# Altium schematic sheet TX1Powerthing.SchDoc
size A
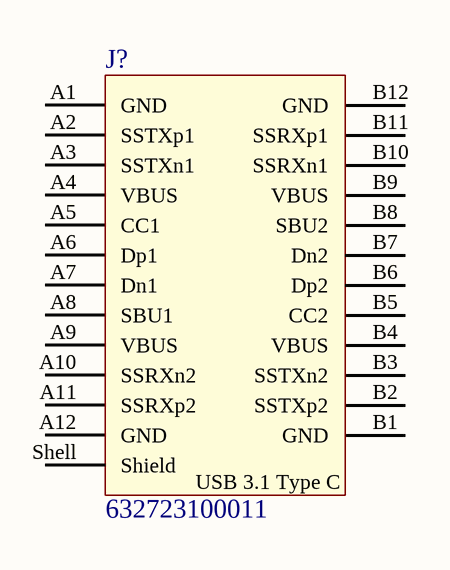
[diagram p0: TX1Powerthing.SchDoc]

## Parts
J?  632723100011  [632723100011]

## Nets

Not connected (* = marked no-connect by the designer): J? A1(GND) A2(SSTXp1) A3(SSTXn1) A4(VBUS) A5(CC1) A6(Dp1) A7(Dn1) A8(SBU1) A9(VBUS) A10(SSRXn2) A11(SSRXp2) A12(GND) B1(GND) B2(SSTXp2) B3(SSTXn2) B4(VBUS) B5(CC2) B6(Dp2) B7(Dn2) B8(SBU2) B9(VBUS) B10(SSRXn1) B11(SSRXp1) B12(GND) Shell(Shield)

## Notes on the sheet
- (in symbol 632723100011) USB 3.1 Type C

## Library data of the parts
J? = 632723100011: USB 3.1 Type C Receptacle Horizontal THR WR-COM; Interface Type: Type C; Sub-Family: USB 3.1; ComponentLink1Description: Manufacturer; ComponentLink1URL: http://www.we-online.de; ComponentLink2Description: Datasheet; ComponentLink2URL: http://katalog.we-online.de/em/datasheet/632723x00011.pdf; Part Number: 632723100011; Published Date: April 2017; Publisher: Wurth Elektronik; Gender: Receptacle; Type: Horizontal; Construction: THR